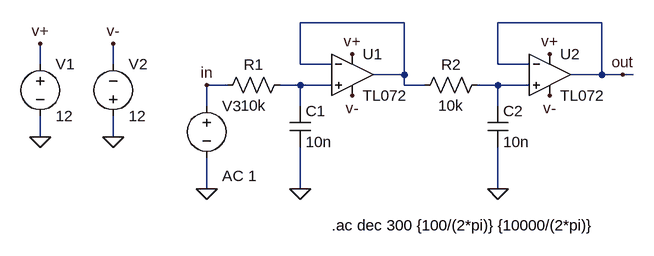
[diagram p0: schematic analisis_frecuencia.asc]
analisis_frecuencia.asc, the LTspice schematic file:
Version 4
SHEET 1 880 680
WIRE 352 48 192 48
WIRE 656 48 496 48
WIRE -208 112 -208 80
WIRE -96 112 -96 80
WIRE 192 112 192 48
WIRE 240 112 192 112
WIRE 496 112 496 48
WIRE 544 112 496 112
WIRE 352 128 352 48
WIRE 352 128 304 128
WIRE 656 128 656 48
WIRE 656 128 608 128
WIRE 688 128 656 128
WIRE 704 128 688 128
WIRE 80 144 48 144
WIRE 192 144 160 144
WIRE 240 144 192 144
WIRE 352 144 352 128
WIRE 384 144 352 144
WIRE 496 144 464 144
WIRE 544 144 496 144
WIRE 48 176 48 144
WIRE 192 176 192 144
WIRE 496 176 496 144
WIRE -208 224 -208 192
WIRE -96 224 -96 192
WIRE 48 304 48 256
WIRE 192 304 192 240
WIRE 496 304 496 240
FLAG -208 224 0
FLAG -96 224 0
FLAG 192 304 0
FLAG 48 304 0
FLAG 496 304 0
FLAG -208 80 v+
FLAG 272 96 v+
FLAG 576 96 v+
FLAG -96 80 v-
FLAG 272 160 v-
FLAG 576 160 v-
FLAG 688 128 out
FLAG 48 144 in
SYMBOL TL072 272 64 R0
SYMATTR InstName U1
SYMBOL voltage -208 96 R0
SYMATTR InstName V1
SYMATTR Value 12
SYMBOL voltage -96 208 M180
WINDOW 0 24 96 Left 2
WINDOW 3 24 16 Left 2
SYMATTR InstName V2
SYMATTR Value 12
SYMBOL res 176 128 R90
WINDOW 0 0 56 VBottom 2
WINDOW 3 32 56 VTop 2
SYMATTR InstName R1
SYMATTR Value 10k
SYMBOL cap 176 176 R0
SYMATTR InstName C1
SYMATTR Value 10n
SYMBOL voltage 48 160 R0
WINDOW 123 24 124 Left 2
WINDOW 39 0 0 Left 0
SYMATTR InstName V3
SYMATTR Value ""
SYMATTR Value2 AC 1
SYMBOL TL072 576 64 R0
SYMATTR InstName U2
SYMBOL res 480 128 R90
WINDOW 0 0 56 VBottom 2
WINDOW 3 32 56 VTop 2
SYMATTR InstName R2
SYMATTR Value 10k
SYMBOL cap 480 176 R0
SYMATTR InstName C2
SYMATTR Value 10n
TEXT 240 360 Left 2 !.ac dec 300 {100/(2*pi)} {10000/(2*pi)}

The netlist it stands for:
* analisis_frecuencia.asc
* U1: TL072 (symbol TL072 not available, pins judged from their places): In+=N002 In-=N001 V+=v+ V-=v- OUT=N001
V1 v+ 0 12
V2 0 v- 12
R1 N002 in 10k
C1 N002 0 10n
V3 in 0 AC 1
* U2: TL072 (symbol TL072 not available, pins judged from their places): In+=N003 In-=out V+=v+ V-=v- OUT=out
R2 N003 N001 10k
C2 N003 0 10n
.ac dec 300 {100/(2*pi)} {10000/(2*pi)}
.backanno
.end